# Altium schematic sheet LPCB235 - HEC1-4.SchDoc
size A3; Address1: Factory 10; Address2: 9-13 Dingley Avenue, Dandeong, VICTORIA 3175, AUSTRALIA; DocumentNumber: 4; Revision: 1; SheetNumber: 4; SheetTotal: 37; Lockie__PCB_SUB_ASSEMBLY: HEC 1-4; Lockie__PCB_ASSEMBLY: FCU PCB; Lockie__LDL: LPCB235; Lockie__PCB_DESCRIPTION: Flight Control Unit
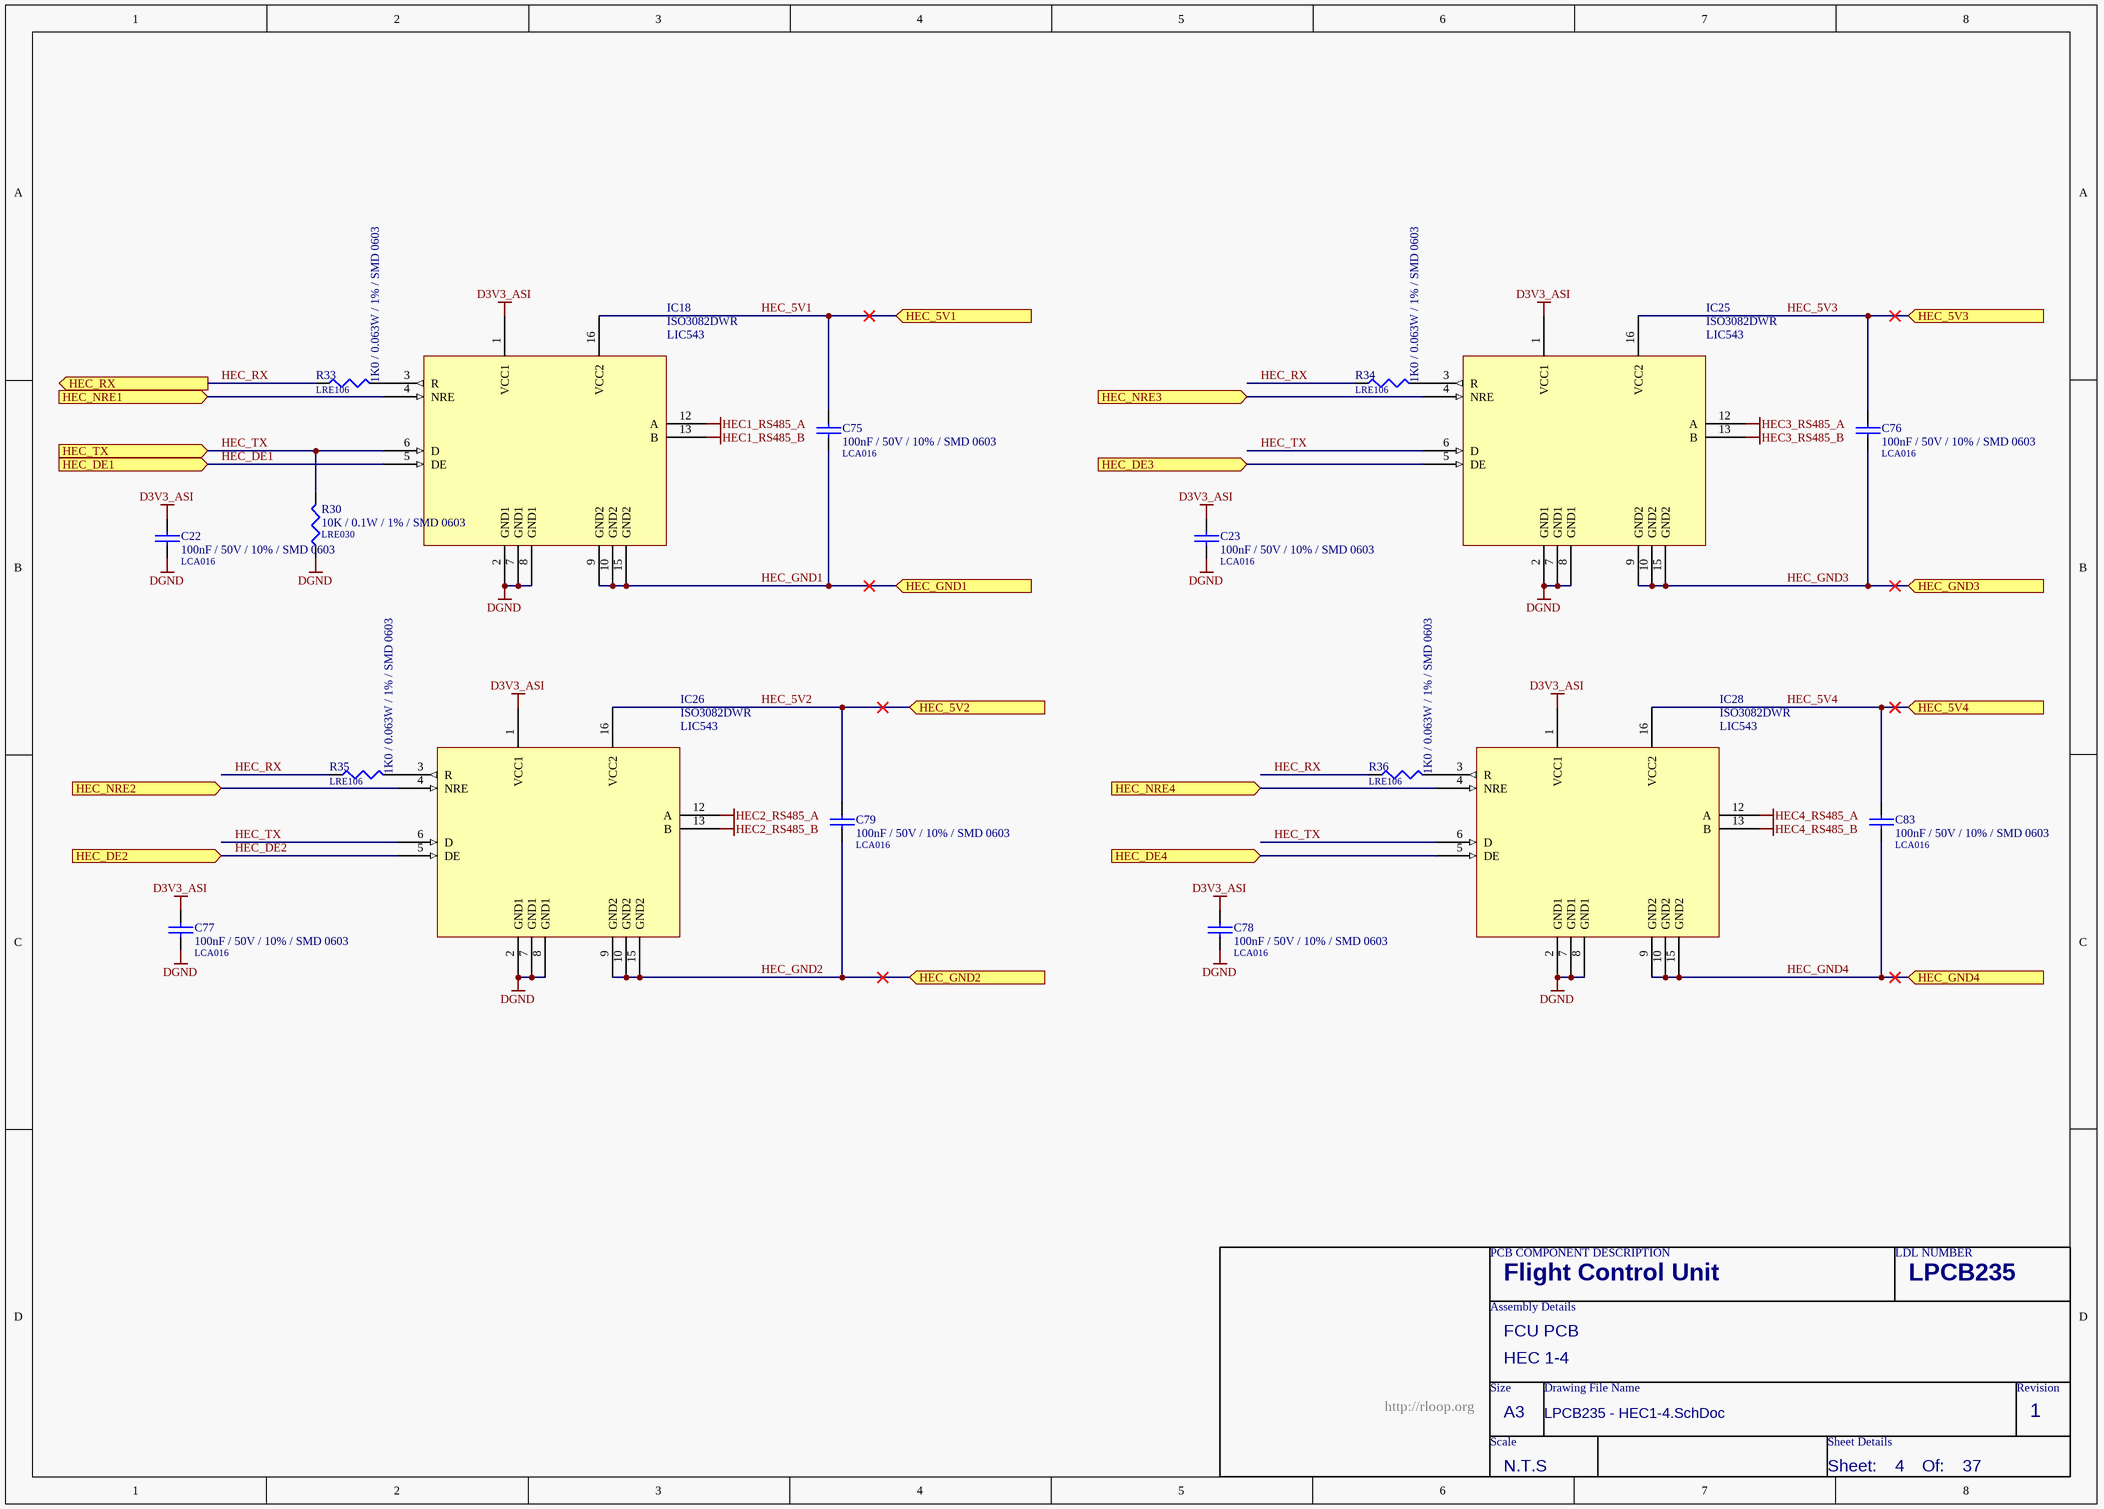
[diagram p0: LPCB235 - HEC1-4.SchDoc]

## Parts
C22  100nF / 50V / 10% / SMD 0603  LDL_NUMBER: LCA016  [LFP011__CC1608-0603-IPC7351_B]
C23  100nF / 50V / 10% / SMD 0603  LDL_NUMBER: LCA016  [LFP011__CC1608-0603-IPC7351_B]
C75  100nF / 50V / 10% / SMD 0603  LDL_NUMBER: LCA016  [LFP011__CC1608-0603-IPC7351_B]
C76  100nF / 50V / 10% / SMD 0603  LDL_NUMBER: LCA016  [LFP011__CC1608-0603-IPC7351_B]
C77  100nF / 50V / 10% / SMD 0603  LDL_NUMBER: LCA016  [LFP011__CC1608-0603-IPC7351_B]
C78  100nF / 50V / 10% / SMD 0603  LDL_NUMBER: LCA016  [LFP011__CC1608-0603-IPC7351_B]
C79  100nF / 50V / 10% / SMD 0603  LDL_NUMBER: LCA016  [LFP011__CC1608-0603-IPC7351_B]
C83  100nF / 50V / 10% / SMD 0603  LDL_NUMBER: LCA016  [LFP011__CC1608-0603-IPC7351_B]
IC18  ISO3082DWR  LDL_NUMBER: LIC543  [LFP068__SO-G16/G6.9]
IC25  ISO3082DWR  LDL_NUMBER: LIC543  [LFP068__SO-G16/G6.9]
IC26  ISO3082DWR  LDL_NUMBER: LIC543  [LFP068__SO-G16/G6.9]
IC28  ISO3082DWR  LDL_NUMBER: LIC543  [LFP068__SO-G16/G6.9]
R30  10K / 0.1W / 1% / SMD 0603  LDL_NUMBER: LRE030  [LFP020__CR1608-0603-IPC7351_B]
R33  1K0 / 0.063W / 1% / SMD 0603  LDL_NUMBER: LRE106  [LFP020__CR1608-0603-IPC7351_B]
R34  1K0 / 0.063W / 1% / SMD 0603  LDL_NUMBER: LRE106  [LFP020__CR1608-0603-IPC7351_B]
R35  1K0 / 0.063W / 1% / SMD 0603  LDL_NUMBER: LRE106  [LFP020__CR1608-0603-IPC7351_B]
R36  1K0 / 0.063W / 1% / SMD 0603  LDL_NUMBER: LRE106  [LFP020__CR1608-0603-IPC7351_B]

## Ports
HEC_5V1 (in), HEC_5V2 (in), HEC_5V3 (in), HEC_5V4 (in), HEC_DE1 (in), HEC_DE2 (in), HEC_DE3 (in), HEC_DE4 (in), HEC_GND1 (in), HEC_GND2 (in), HEC_GND3 (in), HEC_GND4 (in), HEC_NRE1 (in), HEC_NRE2 (in), HEC_NRE3 (in), HEC_NRE4 (in), HEC_RX (out), HEC_TX (in)

## Nets
D3V3_ASI: C22.1 C23.1 C77.1 C78.1 IC18.1(VCC1) IC25.1(VCC1) IC26.1(VCC1) IC28.1(VCC1)
DGND: C22.2 C23.2 C77.2 C78.2 IC18.2(GND1) IC18.7(GND1) IC18.8(GND1) IC25.2(GND1) IC25.7(GND1) IC25.8(GND1) IC26.2(GND1) IC26.7(GND1) IC26.8(GND1) IC28.2(GND1) IC28.7(GND1) IC28.8(GND1) R30.1
HEC1_RS485_A: IC18.12(A)
HEC1_RS485_B: IC18.13(B)
HEC2_RS485_A: IC26.12(A)
HEC2_RS485_B: IC26.13(B)
HEC3_RS485_A: IC25.12(A)
HEC3_RS485_B: IC25.13(B)
HEC4_RS485_A: IC28.12(A)
HEC4_RS485_B: IC28.13(B)
HEC_5V1: C75.1 IC18.16(VCC2) ; port HEC_5V1
HEC_5V2: C79.1 IC26.16(VCC2) ; port HEC_5V2
HEC_5V3: C76.1 IC25.16(VCC2) ; port HEC_5V3
HEC_5V4: C83.1 IC28.16(VCC2) ; port HEC_5V4
HEC_DE1: IC18.5(DE) ; port HEC_DE1
HEC_DE2: IC26.5(DE) ; port HEC_DE2
HEC_DE3: IC25.5(DE) ; port HEC_DE3
HEC_DE4: IC28.5(DE) ; port HEC_DE4
HEC_GND1: C75.2 IC18.9(GND2) IC18.10(GND2) IC18.15(GND2) ; port HEC_GND1
HEC_GND2: C79.2 IC26.9(GND2) IC26.10(GND2) IC26.15(GND2) ; port HEC_GND2
HEC_GND3: C76.2 IC25.9(GND2) IC25.10(GND2) IC25.15(GND2) ; port HEC_GND3
HEC_GND4: C83.2 IC28.9(GND2) IC28.10(GND2) IC28.15(GND2) ; port HEC_GND4
HEC_NRE1: IC18.4(NRE) ; port HEC_NRE1
HEC_NRE2: IC26.4(NRE) ; port HEC_NRE2
HEC_NRE3: IC25.4(NRE) ; port HEC_NRE3
HEC_NRE4: IC28.4(NRE) ; port HEC_NRE4
HEC_RX: R33.1 R34.1 R35.1 R36.1 ; port HEC_RX
HEC_TX: IC18.6(D) IC25.6(D) IC26.6(D) IC28.6(D) R30.2 ; port HEC_TX
NetIC18_3: IC18.3(R) R33.2
NetIC25_3: IC25.3(R) R34.2
NetIC26_3: IC26.3(R) R35.2
NetIC28_3: IC28.3(R) R36.2

## Notes on the sheet
- PCB COMPONENT DESCRIPTION
- LDL NUMBER
- Assembly Details
- Size
- Drawing File Name
- Revision
- http://rloop.org
- Scale
- A3
- Sheet Details
- N.T.S
- Sheet:
- Of:

## Library data of the parts
C22 C23 C75-C79 C83 = 100nF / 50V / 10% / SMD 0603: Capacitor, Ceramic Chip, 100nF (0.1uF), 50V, 5%, SMD 0603 [LCA016]; Value: 100n; FMEDA__OPERATING__VOLTAGE_MIN: 0; FMEDA__OPERATING__VOLTAGE_MAX: 3.3; FMEDA__OPERATING__TEMP_MIN: -20; FMEDA__OPERATING__TEMP_TYP: 27; FMEDA__OPERATING__TEMP_MAX: 50; FMEDA__CHANNEL: COM; FMEDA__FUNCTION_IN_SYSTEM: *; FMEDA__OPERATING__VOLTAGE_TYP: 3.3
IC18 IC25 IC26 IC28 = ISO3082DWR: IC, RS485 Isolator, SMD SOIC 16 [LIC543]
R30 = 10K / 0.1W / 1% / SMD 0603: Resistor, Ceramic Chip, 10K, 0.1W, 1%, SMD 0603 [LRE030]; FMEDA__OPERATING__POWER_MAX: 0; FMEDA__OPERATING__TEMP_MAX: 50; FMEDA__OPERATING__TEMP_MIN: -20; FMEDA__OPERATING__TEMP_TYP: 27; FMEDA__CHANNEL: COM; Value: 10K; FMEDA__OPERATING__POWER_MIN: 0; FMEDA__OPERATING__VOLTAGE_MAX: 0; FMEDA__OPERATING__VOLTAGE_MIN: 0; FMEDA__OPERATING__VOLTAGE_TYP: 0; FMEDA__FUNCTION_IN_SYSTEM: *
R33-R36 = 1K0 / 0.063W / 1% / SMD 0603: Resistor, Ceramic Chip, 1K0, 0.063W, 1%, SMD 0603 [LRE106]; Value: 1K; FMEDA__OPERATING__POWER_MAX: 0; FMEDA__OPERATING__TEMP_MAX: 50; FMEDA__OPERATING__TEMP_MIN: -20; FMEDA__OPERATING__TEMP_TYP: 27; FMEDA__CHANNEL: COM; FMEDA__OPERATING__POWER_MIN: 0; FMEDA__OPERATING__VOLTAGE_MAX: 0; FMEDA__OPERATING__VOLTAGE_MIN: 0; FMEDA__OPERATING__VOLTAGE_TYP: 0; FMEDA__FUNCTION_IN_SYSTEM: *